# Altium schematic sheet Driver and FETs.SchDoc
size B
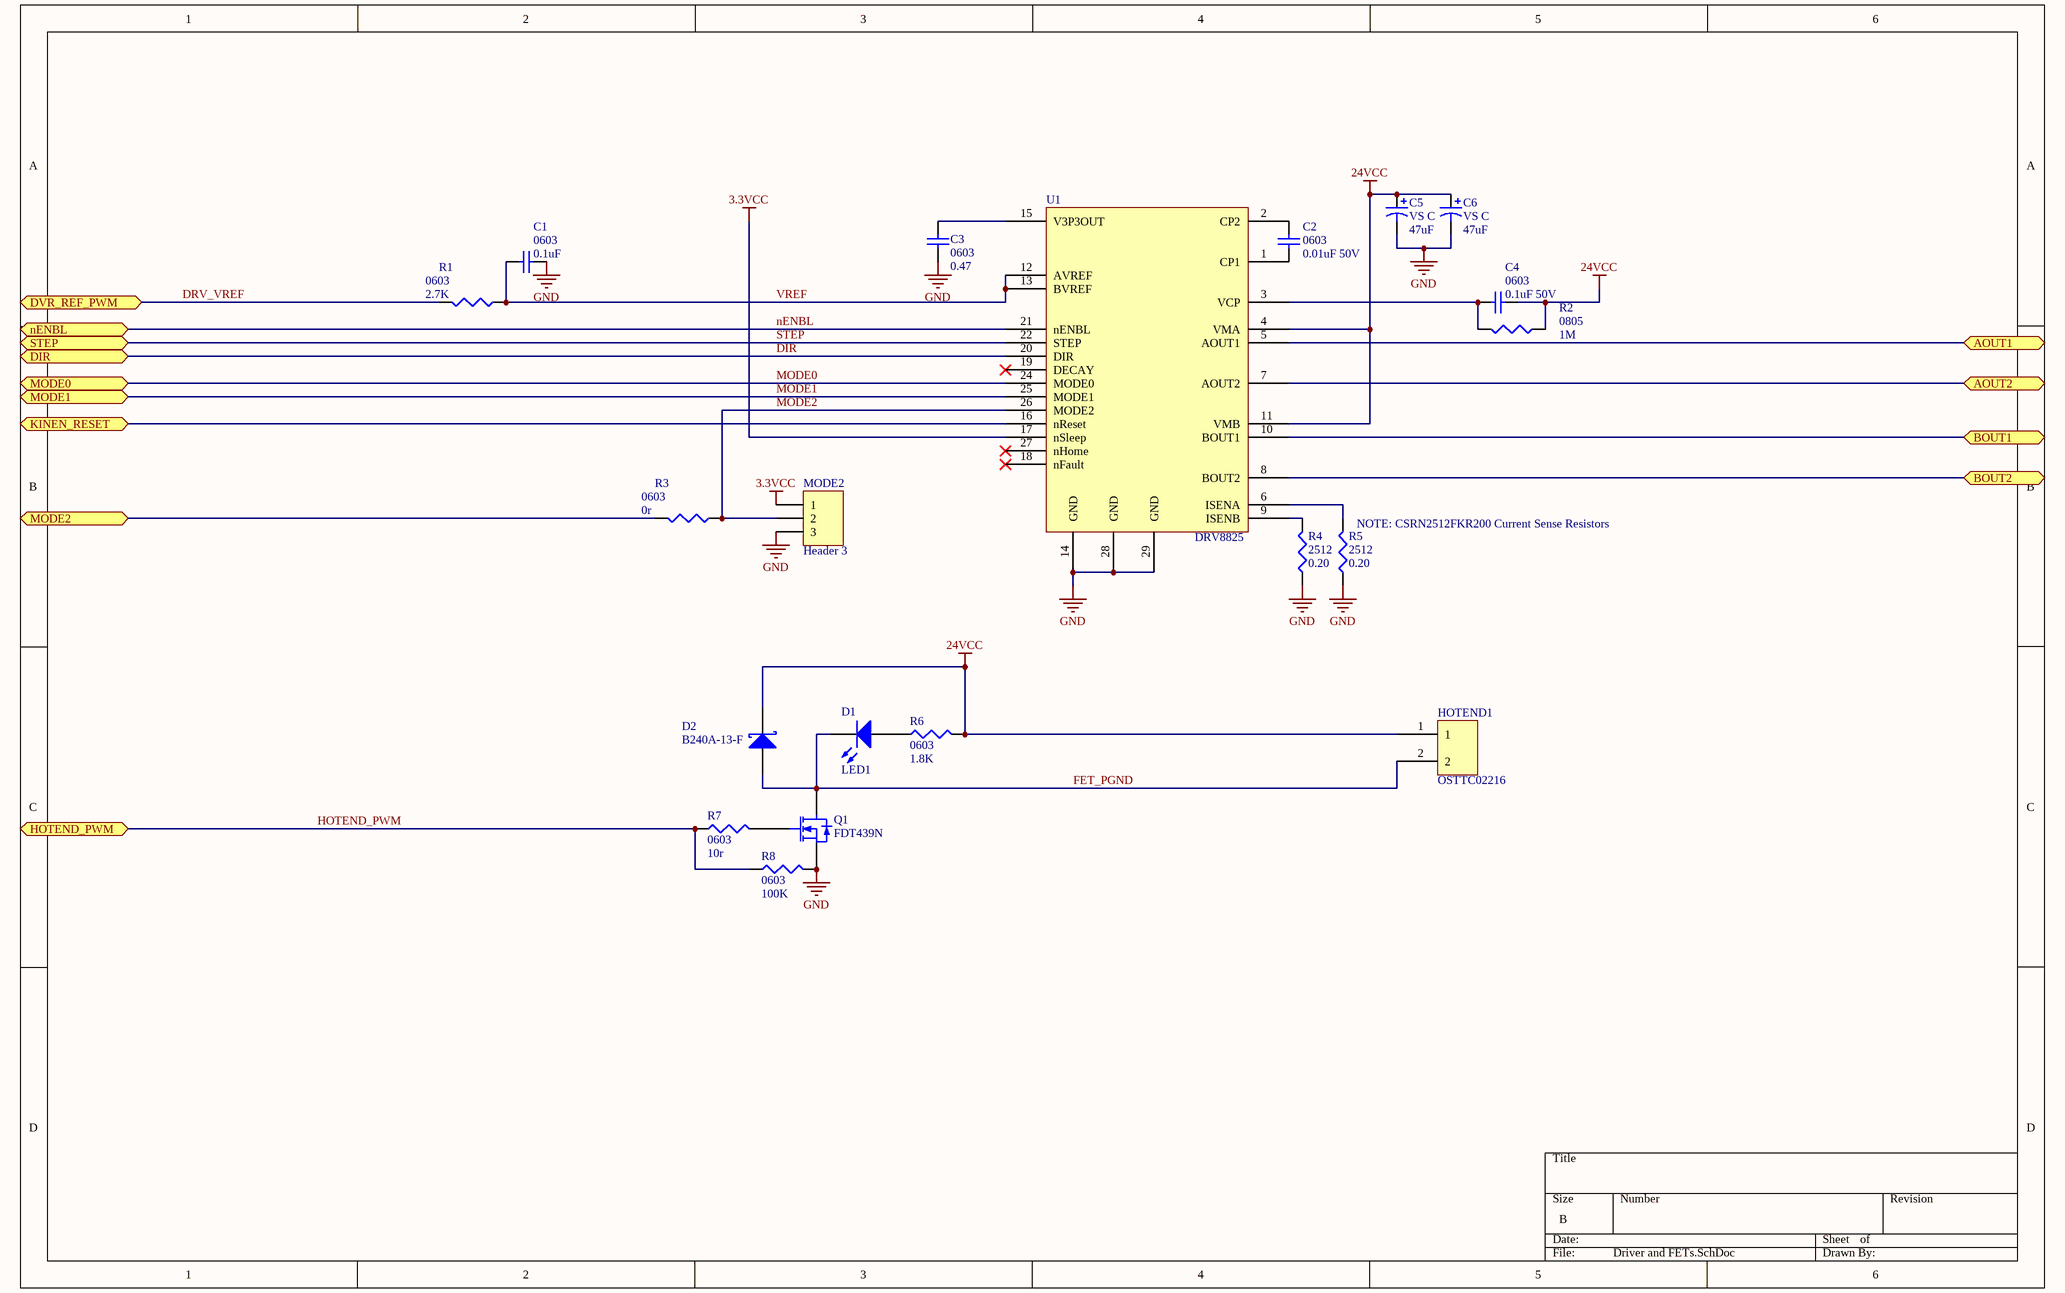
[diagram p0: Driver and FETs.SchDoc]

## Parts
C1  0603  value 0.1uF  [1608[0603]]
C2  0603  value 0.01uF 50V  [1608[0603]]
C3  0603  value 0.47  [1608[0603]]
C4  0603  value 0.1uF 50V  [1608[0603]]
C5  VS C  value 47uF  [Panasonic VS C]
C6  VS C  value 47uF  [Panasonic VS C]
D1  LED1  [SM 0805 polarized]
D2  B240A-13-F  [B240A-13-F]
HOTEND1  OSTTC02216  [OSTTC02216]
MODE2  Header 3  [HDR1X3]
Q1  FDT439N  [Fairchild FDT439N]
R1  0603  value 2.7K  [J1-0603]
R2  0805  value 1M  [SM 0805 - gap trimmed]
R3  0603  value 0r  [J1-0603]
R4  2512  value 0.20  [Resistor2512]
R5  2512  value 0.20  [Resistor2512]
R6  0603  value 1.8K  [J1-0603]
R7  0603  value 10r  [J1-0603]
R8  0603  value 100K  [J1-0603]
U1  DRV8825  [DRV8825]

## Ports
AOUT1, AOUT2, BOUT1, BOUT2, DIR, DVR_REF_PWM, HOTEND_PWM, KINEN_RESET, MODE0, MODE1, MODE2, nENBL, STEP

## Nets
2: Q1.4(D)
3.3VCC: MODE2.1 U1.17(nSleep)
24VCC: C4.1 C5.1 C6.1 D2.2(K) HOTEND1.1 R2.1 R6.2 U1.4(VMA) U1.11(VMB)
GND: C1.1 C3.1 C5.2 C6.2 MODE2.3 Q1.3(S) R4.1 R5.1 R8.2 U1.14(GND) U1.28(GND) U1.29(GND)
AOUT1: U1.5(AOUT1) ; port AOUT1
AOUT2: U1.7(AOUT2) ; port AOUT2
BOUT1: U1.10(BOUT1) ; port BOUT1
BOUT2: U1.8(BOUT2) ; port BOUT2
DIR: U1.20(DIR) ; port DIR
DRV_VREF: R1.2 ; port DVR_REF_PWM
FET_PGND: D1.2(K) D2.1(A) HOTEND1.2 Q1.2(D)
HOTEND_PWM: R7.1 R8.1 ; port HOTEND_PWM
KINEN_RESET: U1.16(nReset) ; port KINEN_RESET
MODE0: U1.24(MODE0) ; port MODE0
MODE1: U1.25(MODE1) ; port MODE1
MODE2: MODE2.2 R3.1 U1.26(MODE2)
MODE2: R3.2 ; port MODE2  [a separate net that carries the same name]
nENBL: U1.21(nENBL) ; port nENBL
STEP: U1.22(STEP) ; port STEP
VREF: C1.2 R1.1 U1.12(AVREF) U1.13(BVREF)
NetC2_1: C2.1 U1.1(CP1)
NetC2_2: C2.2 U1.2(CP2)
NetC3_2: C3.2 U1.15(V3P3OUT)
NetC4_2: C4.2 R2.2 U1.3(VCP)
NetD1_1: D1.1(A) R6.1
NetQ1_1: Q1.1(G) R7.2
NetR4_2: R4.2 U1.9(ISENB)
NetR5_2: R5.2 U1.6(ISENA)

Not connected (* = marked no-connect by the designer): U1 18(nFault)* 19(DECAY)* 23(NC) 27(nHome)*

## Notes on the sheet
- (near R5) NOTE: CSRN2512FKR200 Current Sense Resistors

## Library data of the parts
C1-C4 = Cap Semi: Capacitor (Semiconductor SIM Model); Published: 8-Jun-2000; LatestRevisionDate: 29-May-2009; LatestRevisionNote: IPC-7351 Footprint Added.; PackageReference: C1206; Publisher: Altium Limited; PackageDescription: Chip Capacitor
C5 C6 = Cap Pol1: Polarized Capacitor (Radial); Published: 8-Jun-2000; LatestRevisionDate: 17-Jul-2002; LatestRevisionNote: Re-released for DXP Platform.; PackageReference: RB7.6-15; Publisher: Altium Limited; PackageDescription: Polarized Capacitor (Radial); 2 Leads
D1 = LED1: Typical RED GaAs LED; Published: 8-Jun-2000; LatestRevisionDate: 08-Jul-2005; LatestRevisionNote: Mech Layer 1 removed.; PackageReference: LED-1; Publisher: Altium Limited; PackageDescription: LED; 2 Leads
D2 = D Schottky: Schottky Diode; Published: 8-Jun-2000; LatestRevisionDate: 17-Jul-2002; LatestRevisionNote: Re-released for DXP Platform.; PackageReference: SMB; Publisher: Altium Limited; PackageDescription: DO-214-AA/SMB; 2 C-Bend Leads; Body 5.3 x 3.6 mm, inc. leads (LxW); Code_JEDEC: DO-214-AA
HOTEND1 = Pheonix Contact 2X1
MODE2 = Header 3: Header, 3-Pin; LatestRevisionDate: 17-Jul-2002; LatestRevisionNote: Re-released for DXP Platform.; Publisher: Altium Limited
Q1 = Fairchild FDT439N: N-Channel MOSFET; Published: 8-Jun-2000; LatestRevisionDate: 17-Jul-2002; LatestRevisionNote: Re-released for DXP Platform.; PackageVersion: 1995/1996; PackageReference: E3; Publisher: Altium Limited; PackageDescription: TO, Flat Index; 3 In-Line, Axial Leads; Body Dia. 4.6mm; Lead Dia. 0.5 mm (max)
R1-R8 = Res3: Resistor; Published: 8-Jun-2000; LatestRevisionDate: 29-May-2009; LatestRevisionNote: IPC-7351 Footprint Added.; PackageReference: J1-0603; Publisher: Altium Limited; PackageDescription: Chip Resistor
U1 = DRV8825: DRV8825 Ti Stepper Driver